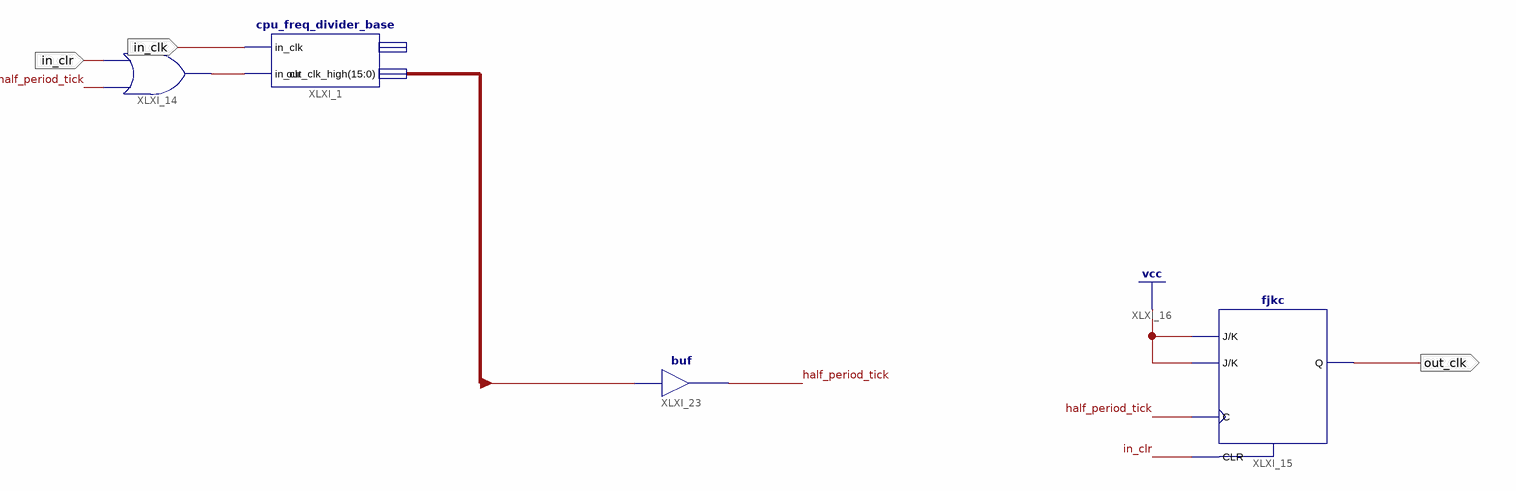
[diagram p0: schematic sheet 1]
// Xilinx ISE schematic cpu_freq_divider_1Inst.sch (aspartan6) as structural Verilog: 4 symbols, 3 ports
module cpu_freq_divider_1Inst (
  input  in_clk,
  input  in_clr,
  output out_clk
);

  wire half_period_tick, XLXN_37;
  wire [15:0] high;

  cpu_freq_divider_base XLXI_1 (.in_clk(in_clk), .in_clr(XLXN_37), .out_clk_high(high));  // open: out_clk_low
  or XLXI_14 (XLXN_37, half_period_tick, in_clr);
  fjkc XLXI_15 (.C(half_period_tick), .CLR(in_clr), .J(1'b1), .K(1'b1), .Q(out_clk));
  buf XLXI_23 (half_period_tick, high[3]);
endmodule
